# Altium schematic sheet UNG8077_EVB_7801-9031_A_3-7801.SchDoc
size 416 x 264 mm; SheetNumber: 3; PageTitle: USB LAN7801_Pwr; PageSetup: Record=PageOptions|CenterHorizontal=True|CenterVertical=True|PrintScale=1.02|XCorrection=1.00|YCorrection=1.00|PrintKind=0|BorderSize=5000000|LeftOffset=0|BottomOffset=0|Orientation=2|PaperLength=1000|PaperWidth=1000|Scale=100|PaperSource=7|PrintQuality=-3|MediaType=1|DitherType=10|PrintScaleMode=1|PaperKind=11 x 17|PaperIndex=119; DocumentFullPathAndName: //depot_np_hweng_boards/ung_hweng/UNG_8077_LAN7801-KSZ9031_DemoEVB/A/
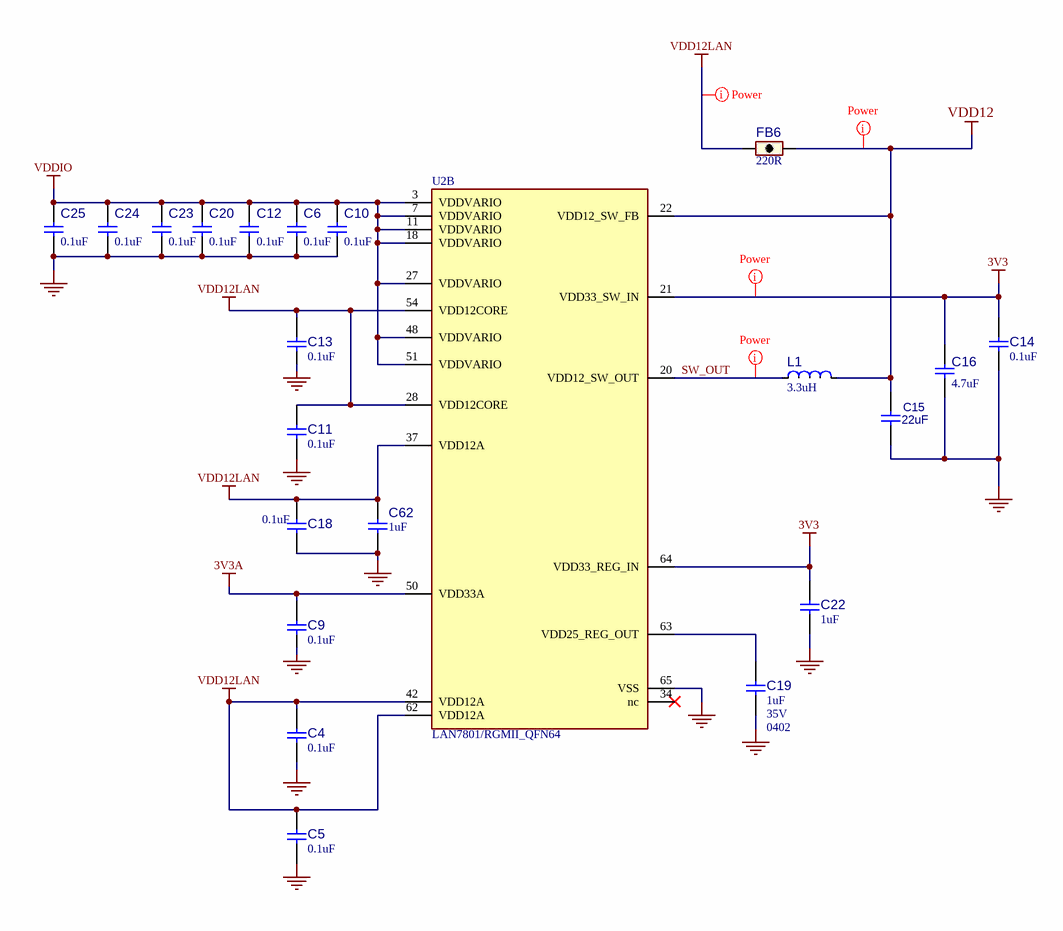
[diagram p0: UNG8077_EVB_7801-9031_A_3-7801.SchDoc]

## Parts
?  (no value)  (graphical)
C4  value 0.1uF  [CAP_C_0402]  (hidden comment: CAP CER 0.1UF 35V)
C5  value 0.1uF  [CAP_C_0402]  (hidden comment: CAP CER 0.1UF 35V)
C6  value 0.1uF  [CAP_C_0402]  (hidden comment: CAP CER 0.1UF 35V)
C9  value 0.1uF  [CAP_C_0402]  (hidden comment: CAP CER 0.1UF 35V)
C10  value 0.1uF  [CAP_C_0402]  (hidden comment: CAP CER 0.1UF 35V)
C11  value 0.1uF  [CAP_C_0402]  (hidden comment: CAP CER 0.1UF 35V)
C12  value 0.1uF  [CAP_C_0402]  (hidden comment: CAP CER 0.1UF 35V)
C13  value 0.1uF  [CAP_C_0402]  (hidden comment: CAP CER 0.1UF 35V)
C14  value 0.1uF  [CAP_C_0402]  (hidden comment: CAP CER 0.1UF 35V)
C15  22uF  [CAP_C_0805]
C16  value 4.7uF  [CAP_C_0603]  (hidden comment: Capacitor NP)
C18  value 0.1uF  [CAP_C_0402]  (hidden comment: CAP CER 0.1UF 35V)
C19  value 1uF  Voltage: 35V  Package: 0402  [CAP_C_0402]  (hidden comment: Capacitor NP)
C20  value 0.1uF  [CAP_C_0402]  (hidden comment: CAP CER 0.1UF 35V)
C22  value 1uF  [CAP_C_0402]  (hidden comment: Capacitor NP)
C23  value 0.1uF  [CAP_C_0402]  (hidden comment: CAP CER 0.1UF 35V)
C24  value 0.1uF  [CAP_C_0402]  (hidden comment: CAP CER 0.1UF 35V)
C25  value 0.1uF  [CAP_C_0402]  (hidden comment: CAP CER 0.1UF 35V)
C62  value 1uF  [CAP_C_0402]  (hidden comment: Capacitor NP)
FB6  value 220R  [IND_C_0603]  (hidden comment: Ferrite Bead)
L1  value 3.3uH  [IND_CFT_ME3220_L3.2W2.8H2]  (hidden comment: Inductor)
U2  LAN7801/RGMII_QFN64  [QFN-64_9x9_EP6SQ]  (part B of 2)

## Nets
3V3: C14.2 C16.2 C22.2 U2.21(VDD33_SW_IN) U2.64(VDD33_REG_IN)
3V3A: C9.2 U2.50(VDD33A)
GND: C4.1 C5.1 C6.1 C9.1 C10.1 C11.1 C12.1 C13.1 C14.1 C15.1 C16.1 C18.1 C19.1 C20.1 C22.1 C23.1 C24.1 C25.1 C62.1 U2.65(VSS)
VDD12: C15.2 FB6.2 L1.2(F) U2.22(VDD12_SW_FB)
VDD12LAN: C4.2 C5.2 C11.2 C13.2 C18.2 C62.2 FB6.1 U2.28(VDD12CORE) U2.37(VDD12A) U2.42(VDD12A) U2.54(VDD12CORE) U2.62(VDD12A)
VDDIO: C6.2 C10.2 C12.2 C20.2 C23.2 C24.2 C25.2 U2.3(VDDVARIO) U2.7(VDDVARIO) U2.11(VDDVARIO) U2.18(VDDVARIO) U2.27(VDDVARIO) U2.48(VDDVARIO) U2.51(VDDVARIO)
SW_OUT: L1.1(S) U2.20(VDD12_SW_OUT)
NetC19_2: C19.2 U2.63(VDD25_REG_OUT)

Not connected (* = marked no-connect by the designer): U2 34(nc)*

## Layout directives
net class Power (VBUS): 3V3, SW_OUT, VDD12, VDD12LAN

## Notes on the sheet
- Microchip Technology, Inc.
  USB/Network Group - UNG
  www.Microchip.com
- Designed with
- Altium.com <http://go.altium.com/MicrochipLandingPage_Evaluation.html>
- Page Title:
- Project Name:
- Description:
- PN:
- Size:
- B
- Date:
- Designer:
- Sheet
- of
- Rev

## Library data of the parts
? = Title Block B_UNG1_Altium
C4-C6 C9-C14 C18 C20 C23-C25 = CAP1463: Capacitor; Manufacturer 1: TDK Corporation; Manufacturer Part Number 1: C1005X7R1H104K050BB; Tolerance: 10%; Description_: CAP CER 0.1uF 50V 10% X7R SMD 0402; Dev Tools Status: Design; Temperature Coeffcient: X7R; Type: Ceramic; Owner: Jamus Griego; Populated: YES; Revision: A; ComponentLink1URL: https://chn-vm-apps.microchip.com/mchprepo/parts/Datasheets/TDKMLCCCapRange.pdf; ComponentLink1Description: Datasheets; Operating Temperature: -55C to +125C; Category: Capacitor; Supplier 1: Digi-Key; Supplier Part Number 1: 445-5932-1-ND; MCHP-ID: CAP1463; Status: MCL Design; Quantity Override: 1
C15 = CAP CER 22uF 10V 20% X5R SMD 0805: Manufacturer Part Number 1: C2012X5R1A226M125AB; Manufacturer 1: TDK; Owner: Jennifer Hancock; Description_: Capacitor, 22uF, 10V, 20%, X5R, 0805; Populated: Yes; Supplier Part Number 1: 810-C2012X5R1A226M-3; Supplier 1: Mouser; Revision Date: 04/27/2016; Supplier 2: Digi-Key; Supplier Part Number 2: 445-7665-6-ND; Tolerance: 20%; Rating: 10V; Document Link: http://nyusperforce.smsc.com//depot_np_hweng_boards/altium_libraries/datasheets/TDK\TDK_CSeries_Caps.pdf; RoHS: Yes; Value: 22uF
C16 = CAP0397: Capacitor; Manufacturer 1: Panasonic; Manufacturer Part Number 1: ECJ-1VB0J475M; Description_: CAP CER 4.7uF 6.3V 20% X5R SMD 0603; Tolerance: 20%; Temperature Coeffcient: X5R; Type: Ceramic; Populated: Yes; MCHP-ID: CAP0397; Revision: 1; Status: Production; ComponentLink1URL: https://chn-vm-apps.microchip.com/mchprepo/parts/Datasheets/ECJ__General_.pdf; ComponentLink1Description: Datasheet; Operating Temperature: -55C to +85C; Category: Capacitor; Manufacturer 2: Murata; Manufacturer Part Number 2: GRM188R60J475ME19D; Supplier 1: Digi-Key; Supplier Part Number 1: PCC2318CT-ND; Supplier 2: Digi-Key; Supplier Part Number 2: 490-5421-1-ND; Quantity Override: 1
C19 C62 = CAP1338: Capacitor; Manufacturer 1: Murata Electronics North America; Manufacturer Part Number 1: GRM155R6YA105KE11D; Description_: CAP CER 1uF 35V 10% X5R SMD 0402; Dev Tools Status: Design; Tolerance: 10%; Temperature Coeffcient: X5R; Type: Ceramic; Owner: Sam Charles; Populated: YES; MCHP-ID: CAP1338; Revision: A; Status: MCL Design; ComponentLink1URL: https://chn-vm-apps.microchip.com/mchprepo/parts/Datasheets/c02e.pdf; ComponentLink1Description: Datasheet; Operating Temperature: -55C to +85C; Category: Capacitor; Supplier 1: Digi-Key; Supplier Part Number 1: 490-10019-1-ND; Quantity Override: 1
  C19: Symbol: Capacitor NP
C22 = CAP1338: Capacitor; Manufacturer 1: Murata Electronics North America; Manufacturer Part Number 1: GRM155R6YA105KE11D; Voltage: 35V; Description_: CAP CER 1uF 35V 10% X5R SMD 0402; Dev Tools Status: Design; Tolerance: 10%; Temperature Coeffcient: X5R; Type: Ceramic; Owner: Sam Charles; Populated: YES; MCHP-ID: CAP1338; Package: 0402; Revision: A; Status: MCL Design; ComponentLink1URL: https://chn-vm-apps.microchip.com/mchprepo/parts/Datasheets/c02e.pdf; ComponentLink1Description: Datasheet; Operating Temperature: -55C to +85C; Category: Capacitor; Supplier 1: Digi-Key; Supplier Part Number 1: 490-10019-1-ND; Quantity Override: 1
FB6 = IND1313: Manufacturer 1: Murata Electronics North America; Manufacturer Part Number 1: BLM18EG221SN1D; Description_: FERRITE 220R @ 100MHz 2A SMD 0603; Dev Tools Status: Design; Owner: Razvan Cristescu; Populated: YES; MCHP-ID: IND1313; Revision: A; Symbol: Ferrite Bead; Status: MCL Design; ComponentLink1Description: Datasheet; Package: 0603; Type: Ferrite Bead; Category: Inductor; Supplier 1: Digi-Key; Supplier Part Number 1: 490-3992-6-ND; Quantity Override: 1
L1 = IND1290: Manufacturer 1: Coilcraft; Manufacturer Part Number 1: ME3220-332MLB; Description_: INDUCTOR 3.3uH 1.6A 20% SMD ME3220; Dev Tools Status: Production; Owner: Jamus Griego; DCR: 180mR; Test Frequency: 100Khz; Populated: YES; MCHP-ID: IND1290; Revision: 1; Symbol: Inductor; Status: MCL Design; ComponentLink1URL: https://chn-vm-apps.microchip.com/mchprepo/parts/Datasheets/me3220.pdf; ComponentLink1Description: Datasheets; Operating Temperature: - 40 C to + 85 C; Package: L3.2W2.8H2; Type: Inductor; Category: Inductor; Supplier 1: Mouser; Supplier Part Number 1: 994-ME3220-332MLB; Quantity Override: 1
U2 = LAN7801/RGMII_QFN64: Edinburgh LAN7801/RGMII pinout, QFN64; Manufacturer Part Number: Edinburgh_QFN64; Populated: Yes; Owner: Jennifer Hancock; Supplier 1: Microchip; Description_: Edinburgh LAN7801/RGMII pinout, QFN64; Part Checked: *; Part Footprint Checked: *; Part 3D Model Checked: *; Part Golden: *; Supplier Part Number 1: LAN7801/RGMII_QFN64